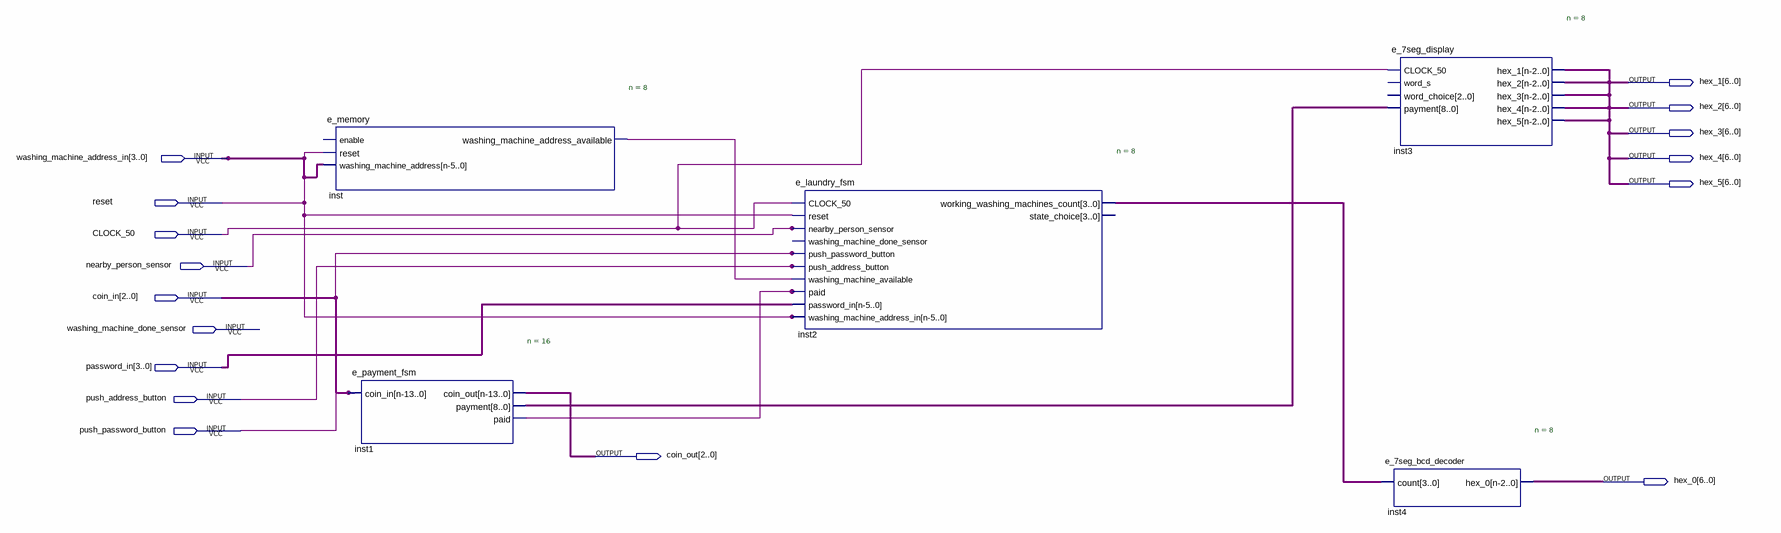
[diagram p0: schematic sheet]
// Quartus schematic block_diagram_chart.bdf as structural Verilog: 5 symbols, 16 pins
module block_diagram_chart (
  input  [3:0] washing_machine_address_in,
  input  reset,
  input  CLOCK_50,
  input  nearby_person_sensor,
  input  [2:0] coin_in,
  input  washing_machine_done_sensor,
  input  [3:0] password_in,
  input  push_address_button,
  input  push_password_button,
  output [6:0] hex_1,
  output [6:0] hex_2,
  output [6:0] hex_3,
  output [6:0] hex_4,
  output [6:0] hex_5,
  output [2:0] coin_out,
  output [6:0] hex_0
);

  wire inst1_paid, inst_washing_machine_address_available, undriven, undriven_2;
  wire [3:0] inst2_working_washing_machines_count;
  wire [8:0] inst1_payment;

  e_memory #(.n(8)) inst (
    .reset(undriven), .washing_machine_address(washing_machine_address_in),
    .washing_machine_address_available(inst_washing_machine_address_available));  // open: enable
  e_payment_fsm #(.n(16)) inst1 (.coin_in(coin_in), .coin_out(coin_out), .payment(inst1_payment), .paid(inst1_paid));
  e_laundry_fsm #(.n(8)) inst2 (
    .CLOCK_50(CLOCK_50), .reset(reset), .nearby_person_sensor(nearby_person_sensor),
    .push_password_button(undriven_2), .push_address_button(push_address_button),
    .washing_machine_available(inst_washing_machine_address_available), .paid(inst1_paid),
    .password_in(password_in), .washing_machine_address_in({4{reset}}),
    .working_washing_machines_count(inst2_working_washing_machines_count));  // open: washing_machine_done_sensor, state_choice
  e_7seg_display #(.n(8)) inst3 (
    .CLOCK_50(CLOCK_50), .payment(inst1_payment), .hex_1(hex_1), .hex_2(hex_1), .hex_3(hex_1), .hex_4(hex_1),
    .hex_5(hex_1));  // open: word_s, word_choice
  e_7seg_bcd_decoder #(.n(8)) inst4 (.count(inst2_working_washing_machines_count), .hex_0(hex_0));

  assign hex_2 = hex_1;
  assign hex_3 = hex_1;
  assign hex_4 = hex_1;
  assign hex_5 = hex_1;
endmodule
